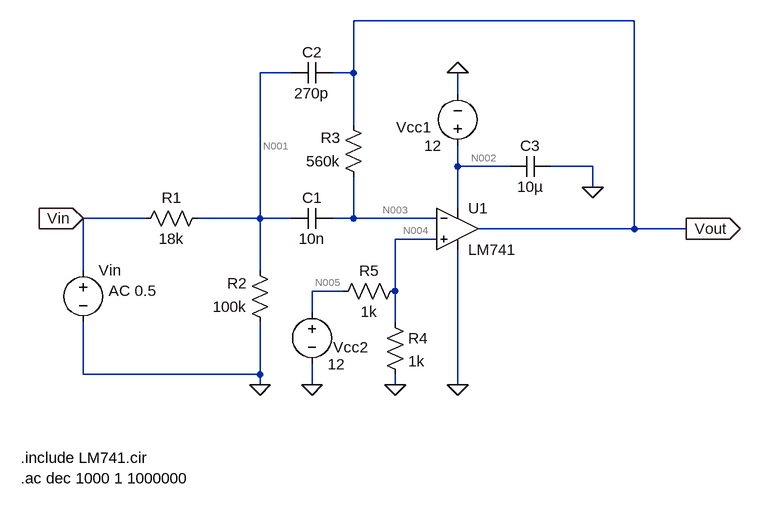
[diagram p0: schematic filtro-passa-banda.asc]
filtro-passa-banda.asc, the LTspice schematic file:
Version 4
SHEET 1 880 680
WIRE 224 -384 -208 -384
WIRE -304 -304 -352 -304
WIRE -208 -304 -208 -384
WIRE -208 -304 -240 -304
WIRE -48 -272 -48 -304
WIRE -208 -224 -208 -304
WIRE -48 -160 -48 -192
WIRE 32 -160 -48 -160
WIRE 160 -160 96 -160
WIRE 160 -128 160 -160
WIRE -48 -96 -48 -160
WIRE -528 -80 -624 -80
WIRE -352 -80 -352 -304
WIRE -352 -80 -448 -80
WIRE -304 -80 -352 -80
WIRE -208 -80 -208 -144
WIRE -208 -80 -240 -80
WIRE -80 -80 -208 -80
WIRE 224 -64 224 -384
WIRE 224 -64 -16 -64
WIRE 304 -64 224 -64
WIRE -80 -48 -144 -48
WIRE -624 0 -624 -80
WIRE -352 0 -352 -80
WIRE -224 32 -272 32
WIRE -144 32 -144 -48
WIRE -272 64 -272 32
WIRE -144 80 -144 32
WIRE -624 160 -624 80
WIRE -352 160 -352 80
WIRE -352 160 -624 160
WIRE -352 176 -352 160
WIRE -272 176 -272 144
WIRE -144 176 -144 160
WIRE -48 176 -48 -32
FLAG -352 176 0
FLAG -144 176 0
FLAG -272 176 0
FLAG -48 176 0
FLAG -48 -304 0
FLAG 160 -128 0
FLAG 304 -64 Vout
IOPIN 304 -64 Out
FLAG -624 -80 Vin
IOPIN -624 -80 In
SYMBOL voltage -624 -16 R0
WINDOW 123 39 47 Left 2
WINDOW 39 0 0 Left 0
SYMATTR InstName Vin
SYMATTR Value ""
SYMATTR Value2 AC 0.5
SYMBOL res -432 -96 R90
WINDOW 0 0 56 VBottom 2
WINDOW 3 32 56 VTop 2
SYMATTR InstName R1
SYMATTR Value 18k
SYMBOL res -336 96 R180
WINDOW 0 36 76 Left 2
WINDOW 3 36 40 Left 2
SYMATTR InstName R2
SYMATTR Value 100k
SYMBOL res -192 -128 R180
WINDOW 0 36 76 Left 2
WINDOW 3 36 40 Left 2
SYMATTR InstName R3
SYMATTR Value 560k
SYMBOL cap -240 -96 R90
WINDOW 0 0 32 VBottom 2
WINDOW 3 32 32 VTop 2
SYMATTR InstName C1
SYMATTR Value 10n
SYMBOL cap -240 -320 R90
WINDOW 0 0 32 VBottom 2
WINDOW 3 32 32 VTop 2
SYMATTR InstName C2
SYMATTR Value 270p
SYMBOL OpAmps\\opamp2 -48 -128 R0
SYMATTR InstName U1
SYMATTR Value LM741
SYMBOL res -160 64 R0
SYMATTR InstName R4
SYMATTR Value 1k
SYMBOL res -128 16 R90
WINDOW 0 0 56 VBottom 2
WINDOW 3 32 56 VTop 2
SYMATTR InstName R5
SYMATTR Value 1k
SYMBOL voltage -272 48 R0
WINDOW 0 33 70 Left 2
WINDOW 123 0 0 Left 0
WINDOW 39 0 0 Left 0
SYMATTR InstName Vcc2
SYMATTR Value 12
SYMBOL voltage -48 -176 R180
WINDOW 0 41 44 Left 2
WINDOW 3 24 16 Left 2
WINDOW 123 0 0 Left 0
WINDOW 39 0 0 Left 0
SYMATTR InstName Vcc1
SYMATTR Value 12
SYMBOL cap 96 -176 R90
WINDOW 0 0 32 VBottom 2
WINDOW 3 32 32 VTop 2
SYMATTR InstName C3
SYMATTR Value 10µ
TEXT -720 288 Left 2 !.include LM741.cir
TEXT -720 320 Left 2 !.ac dec 1000 1 1000000

The netlist it stands for:
* filtro-passa-banda.asc
Vin Vin 0 AC 0.5
R1 N001 Vin 18k
R2 0 N001 100k
R3 N003 Vout 560k
C1 N003 N001 10n
C2 Vout N001 270p
XU1 N004 N003 N002 0 Vout LM741  ; pins In+ In- V+ V- OUT
R4 N004 0 1k
R5 N004 N005 1k
Vcc2 N005 0 12
Vcc1 N002 0 12
C3 0 N002 10µ
.include LM741.cir
.ac dec 1000 1 1000000
.backanno
.end

* Results of the author's LTspice run, read from the files saved beside the schematic
* Operating Point, zero values left out:
*   V(n003) = 6.001 V
*   V(vout) = 6.058 V
*   V(n004) = 6 V
*   V(n002) = 12 V
*   V(n005) = 12 V
*   I(R3) = -101.9 nA
*   I(R4) = 6 mA
*   I(R5) = -6 mA
*   I(Vcc2) = -6 mA
*   I(Vcc1) = -1.476 mA
*   Ix(u1:1) = 57.87 nA
*   Ix(u1:2) = 101.9 nA
*   Ix(u1:99) = 1.476 mA
*   Ix(u1:50) = -1.476 mA
*   Ix(u1:28) = -101.9 nA
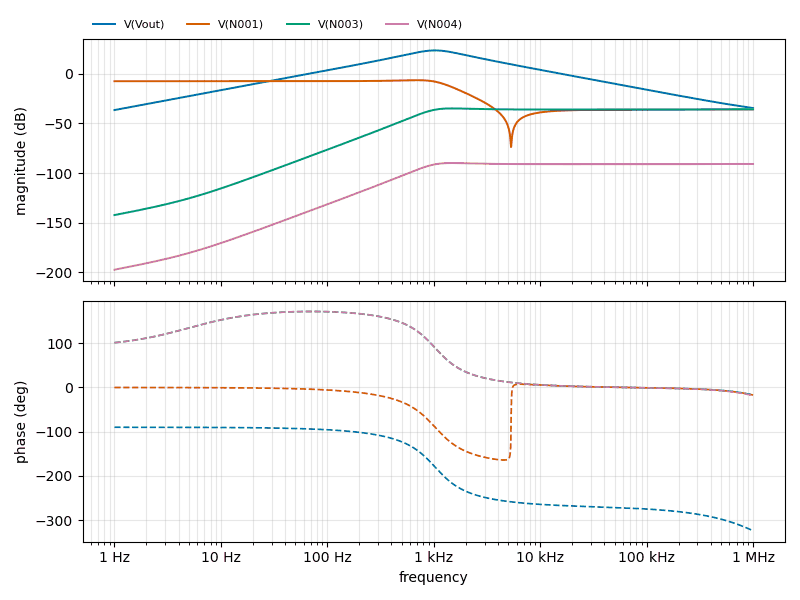
[diagram p1: AC Analysis of filtro-passa-banda.asc, plotted from the saved traces]
* AC Analysis, 1 run:
*   V(Vout): -36.53 dB at 1 Hz, -34.53 dB at 1 MHz, peak 23.59 dB at 1.028 kHz, 3 dB below the peak at 631.1 Hz and 1.672 kHz
*   V(N001): -7.46 dB at 1 Hz, -35.83 dB at 1 MHz, peak -6.44 dB at 695 Hz, 3 dB below the peak at 1.173 kHz
*   V(N003): -142.37 dB at 1 Hz, -35.83 dB at 1 MHz, peak -34.88 dB at 1.472 kHz, 3 dB below the peak at 880.7 Hz
*   V(N004): -197.41 dB at 1 Hz, -90.87 dB at 1 MHz, peak -89.92 dB at 1.472 kHz, 3 dB below the peak at 880.7 Hz